# EAGLE design XBee-NewRoute (EAGLE 7.4.0)
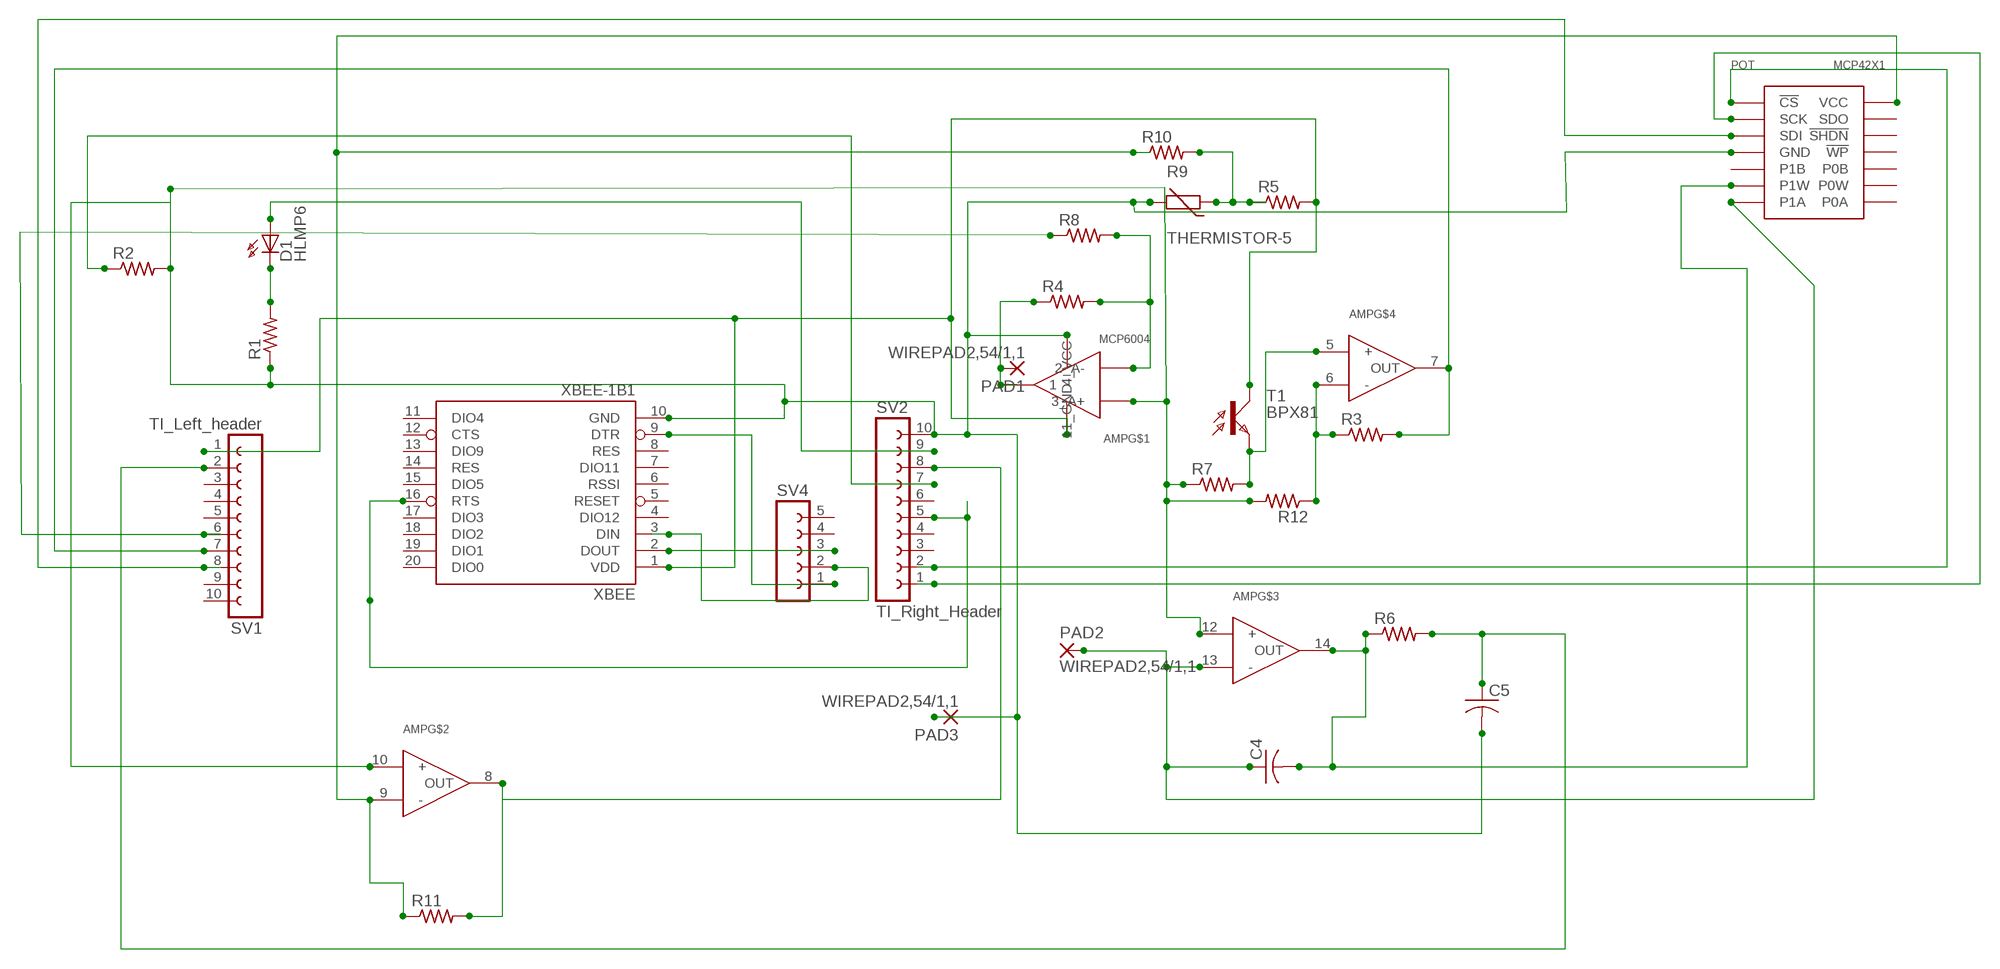
[diagram p0: schematic, sheet 1]

## Parts
AMP  MCP6004  [SO014]
C4  C-USC0603  [C0603]
C5  C-USC0603  [C0603]
D1  HLMP6  [HLMP6]
PAD1  WIREPAD2,54/1,1  [2,54/1,1]
PAD2  WIREPAD2,54/1,1  [2,54/1,1]
PAD3  WIREPAD2,54/1,1  [2,54/1,1]
POT  MCP42X1  MCP42X1_DIGITAL_POTSO014  [SO014]
R1  R-US_R0603  [R0603]
R2  R-US_R0603  [R0603]
R3  R-US_R0603  [R0603]
R4  R-US_R0603  [R0603]
R5  R-US_R0603  [R0603]
R6  R-US_R0603  [R0603]
R7  R-US_R0603  [R0603]
R8  R-US_R0603  [R0603]
R9  THERMISTOR-5  [R-5]
R10  R-US_R0603  [R0603]
R11  R-US_R0603  [R0603]
R12  R-US_R0603  [R0603]
SV1  TI_Left_header  FE10-1  [FE10]
SV2  TI_Right_Header  FE10-1  [FE10]
SV4  FE05-1  [FE05-1]
T1  BPX81  [BPX81]
XBEE  XBEE-1B1  [XBEE-1]

## Nets
GND: AMP.3(3_A+) AMP.10(+) AMP.11(11_GND) AMP.12(+) C5.2 PAD3.1(P) POT.P4(GND) R1.1 R2.2 R7.1 R9.2 R12.2 SV2.10 XBEE.10(GND)
N$1: D1.K R1.2
N$2: AMP.5(+) R7.2 T1.E
N$3: SV4.3 XBEE.2(DOUT)
N$4: SV4.1 XBEE.9(DTR)
N$5: SV4.2 XBEE.3(DIN)
N$6: AMP.6(-) R3.1 R12.1
N$11: R2.1 SV2.7
N$12: AMP.8(OUT) R11.2 SV2.8
N$13: AMP.9(-) POT.P14(VCC) R10.1 R11.1
N$14: AMP.1 PAD1.1(P) R4.1
N$15: D1.A SV2.9
N$17: AMP.13(-) C4.1 PAD2.1(P) POT.P7(P1A)
N$18: AMP.14(OUT) C4.2 POT.P6(P1W) R6.1
N$19: C5.1 R6.2 SV1.2
N$20: R5.1 R9.1 R10.2
N$21: AMP.2(2_A-) R4.2 R8.2
N$22: SV2.5 XBEE.16(RTS)
POT_CS: POT.P1(!CS) SV2.2
POT_SCK: POT.P2(SCK) SV2.1
POT_SDI: POT.P3(SDI) SV1.8
PULSE: R8.1 SV1.6
TI_PN7_READ: AMP.7(OUT) R3.2 SV1.7
VCC: AMP.4(4_VCC) R5.2 SV1.1 T1.C XBEE.1(VDD)
Unconnected: POT.P5(P1B) POT.P8(P0A) POT.P9(P0W) POT.P10(P0B) POT.P11(!WP) POT.P12(!SHDN) POT.P13(SDO) SV1.3 SV1.4 SV1.5 SV1.9 SV1.10 SV2.3 SV2.4 SV2.6 SV4.4 SV4.5 XBEE.4(DIO12) XBEE.5(RESET) XBEE.6(RSSI) XBEE.7(DIO11) XBEE.8(RES) XBEE.11(DIO4) XBEE.12(CTS) XBEE.13(DIO9) XBEE.14(RES) XBEE.15(DIO5) XBEE.17(DIO3) XBEE.18(DIO2) XBEE.19(DIO1) XBEE.20(DIO0)

## Library data of the parts
AMP = SparkFun-AnalogIC:MCP6004: 14SOIC quad op amp, R2R, low power
C4 C5 = rcl:C-US: CAPACITOR, American symbol
D1 = display-hp:HLMP6: LED 2mm horizontal; MF: AGILENT TECHNOLOGIES; MPN: HLMP-6500; OC_FARNELL: 1652490; OC_NEWARK: 40K0088
PAD1-PAD3 = wirepad:WIREPAD: Wire PAD connect wire on PCB
POT = JackLibrary:MCP42X1_DIGITAL_POT
R1-R8 R10-R12 = resistor:R-US_: RESISTOR, American symbol
R9 = varistor:THERMISTOR: THERMISTOR
SV1 SV2 = con-lsta:FE10-1: FEMALE HEADER; OC_FARNELL: unknown; OC_NEWARK: unknown
SV4 = con-lsta:FE05-1: FEMALE HEADER; OC_FARNELL: unknown; OC_NEWARK: unknown
T1 = opto-trans-siemens:BPX81: PHOTO TRANSISTOR; OC_FARNELL: unknown; OC_NEWARK: unknown
XBEE = SparkFun-RF:XBEE-1: Xbee module footprints SMT header is CONN-09042.

## Board
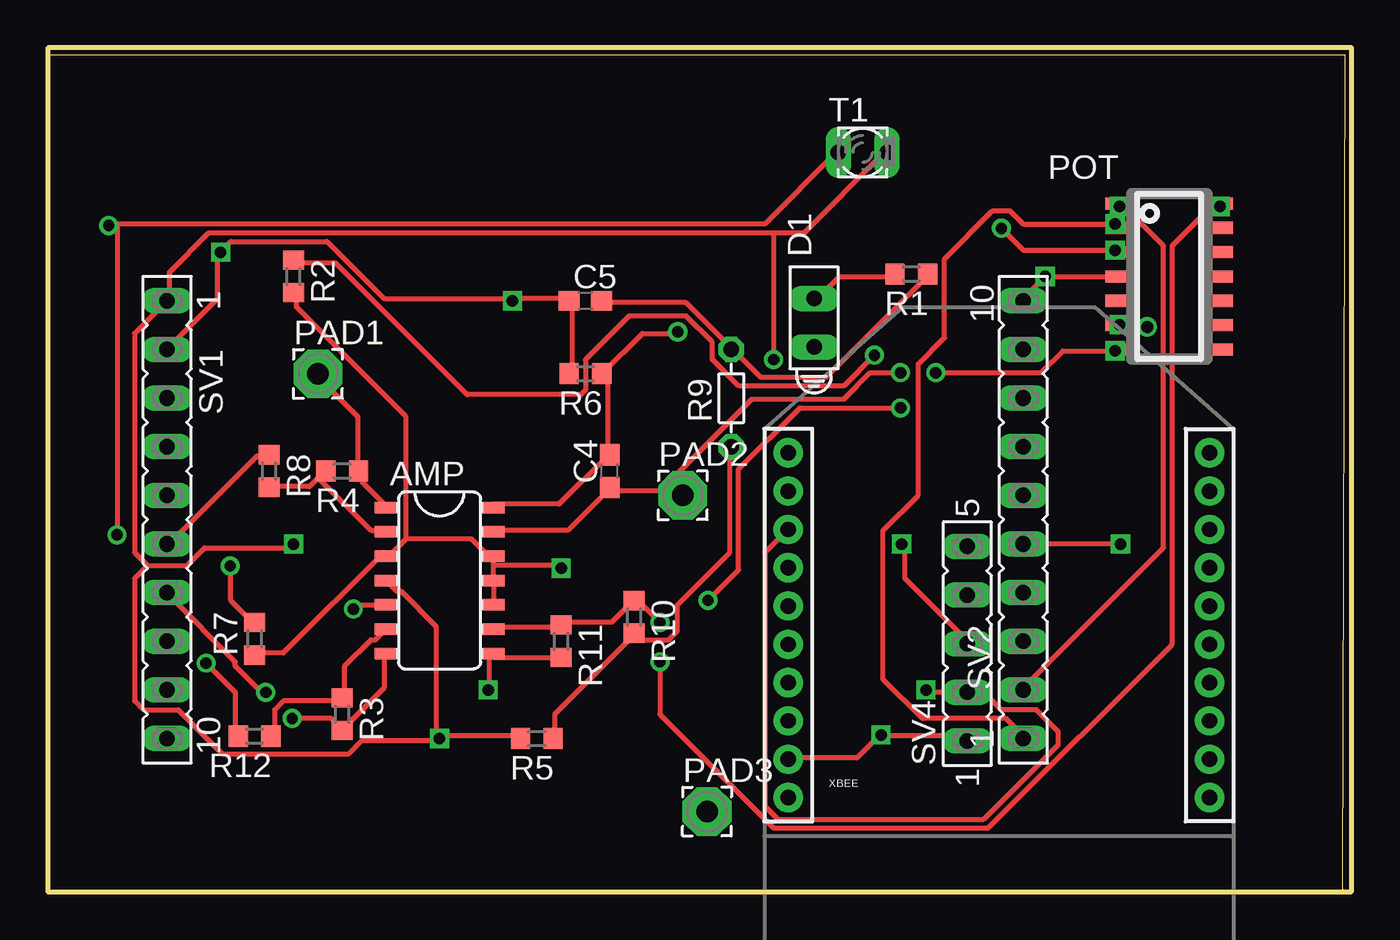
[diagram p1: board, top side]
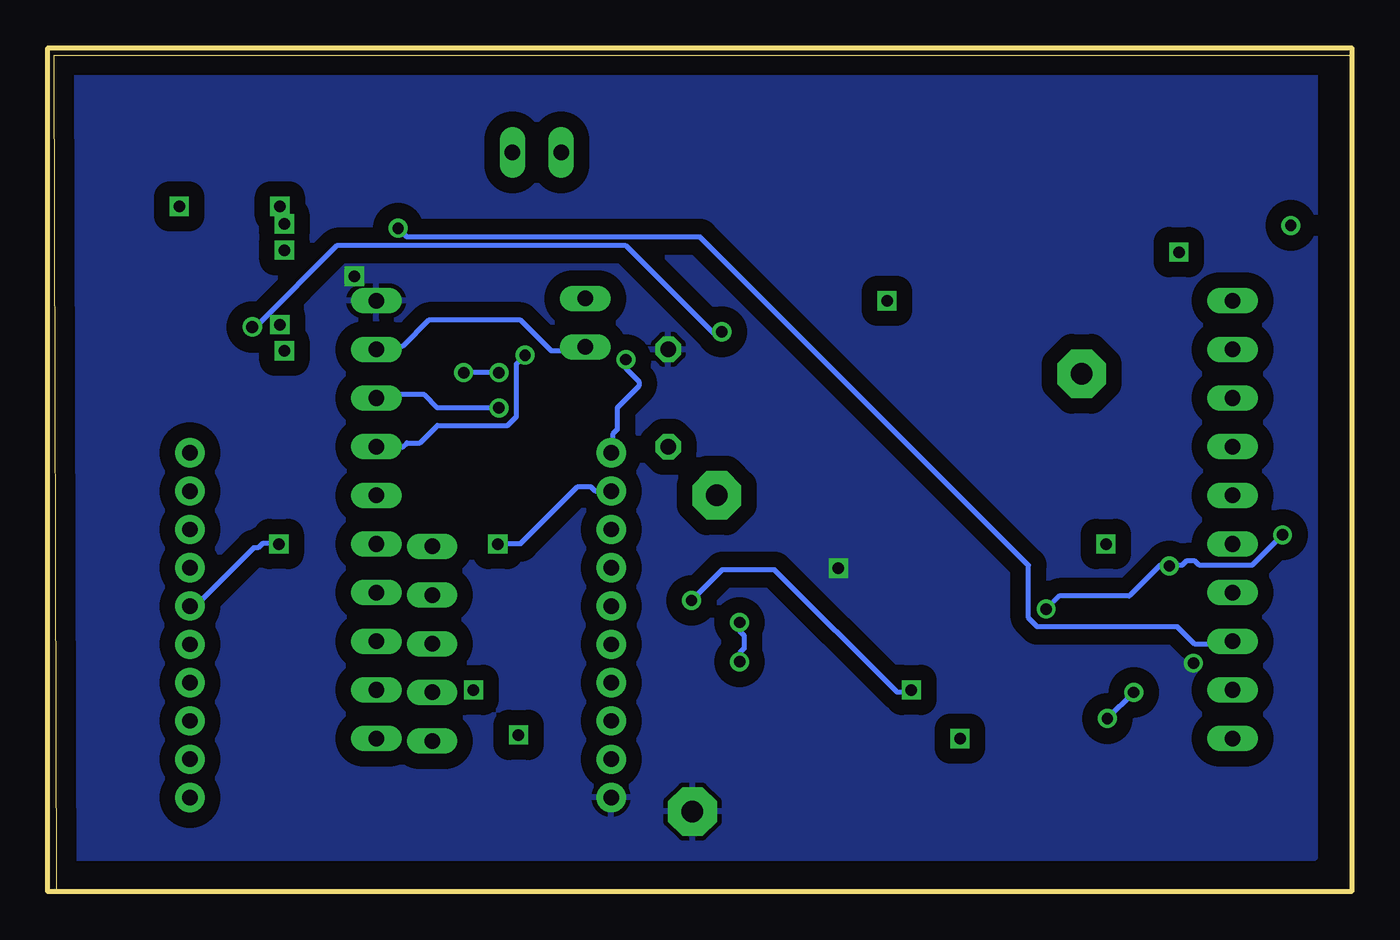
[diagram p2: board, bottom side, seen from below]

Size 68.07 x 44.07 mm. Coordinates in mm from the lower left corner, seen from the top.
Outline: 67.61,0 67.74,43.68 0,43.68
Outline: 0,43.68 0,44.07 68.07,44.07 68.07,0 67.61,0
Outline: 0,43.68 0,0 67.61,0
Copper layers (1*16): Top 0.035mm / dielectric 1.5mm / Bottom 0.035mm
Design rules "default *": minimum track width 10mil, minimum drill 23mil, track to track 8mil, track to pad 8mil, pad to pad 8mil, via to via 8mil, smd to smd 8mil, copper to edge 40mil, drill to drill 8mil, minimum pad ring 10mil, minimum via ring 8mil, stop-mask expansion 4mil, vias tented up to drill 0mil, thermal gap 10mil

### Footprints (pad centres in the part's own frame; a part is rotated, then mirrored left to right if it is on the bottom)
SO014 = smd 0.6 x 1.2: 1 -3.175,-2.8; 2 -1.905,-2.8; 3 -0.635,-2.8; 4 0.635,-2.8; 5 1.905,-2.8; 6 3.175,-2.8; 7 4.445,-2.8; 8 4.445,2.8; 9 3.175,2.8; 10 1.905,2.8; 11 0.635,2.8; 12 -0.635,2.8; 13 -1.905,2.8; 14 -3.175,2.8
C0603 = smd 1.1 x 1: 1 -0.85,0; 2 0.85,0
HLMP6 = drill 0.813 long: A -1.27,0; K 1.27,0
2,54/1,1 = drill 1.118 pad 2.54 octagon: 1 0,0
SO014' = smd 1.27 x 0.635: P1 -2.692,3.81; P2 -2.692,2.54; P3 -2.692,1.27; P4 -2.692,0; P5 -2.692,-1.27; P6 -2.692,-2.54; P7 -2.692,-3.81; P8 2.692,-3.81; P9 2.692,-2.54; P10 2.692,-1.27; P11 2.692,0; P12 2.692,1.27; P13 2.692,2.54; P14 2.692,3.81
R0603 = smd 1 x 1.1: 1 -0.85,0; 2 0.85,0
R-5 = drill 0.813 octagon: 1 -2.54,0; 2 2.54,0
FE10 = drill 0.813 long: 1 -11.43,0; 2 -8.89,0; 3 -6.35,0; 4 -3.81,0; 5 -1.27,0; 6 1.27,0; 7 3.81,0; 8 6.35,0; 9 8.89,0; 10 11.43,0
FE05-1 = drill 0.813 long: 1 -5.08,0; 2 -2.54,0; 3 0,0; 4 2.54,0; 5 5.08,0
BPX81 = drill 0.813 long: C 1.27,0; E -1.27,0
XBEE-1 = drill 0.8 pad 1.524: 1 -11,20; 2 -11,18; 3 -11,16; 4 -11,14; 5 -11,12; 6 -11,10; 7 -11,8; 8 -11,6; 9 -11,4; 10 -11,2; 11 11,2; 12 11,4; 13 11,6; 14 11,8; 15 11,10; 16 11,12; 17 11,14; 18 11,16; 19 11,18; 20 11,20

### Placement (x,y rotation side)
AMP  20.45,16.89 270 top
C4  29.34,21.97 90 top
C5  28.07,30.86 0 top
D1  40,29.72 90 top
PAD1  14.1,27.05 0 top
PAD2  33.15,20.7 0 top
PAD3  34.42,4.19 0 top
POT  MCP42X1  [SO014']  58.55,32.13 0 top
R1  45.09,32.26 180 top
R2  12.83,32.13 270 top
R3  15.37,9.27 270 top
R4  15.37,21.97 180 top
R5  25.53,8 180 top
R6  28.07,27.05 180 top
R7  10.79,13.21 90 top
R8  11.56,21.97 270 top
R9  35.69,25.78 90 top
R10  30.61,14.35 270 top
R11  26.8,13.08 270 top
R12  10.79,8.13 180 top
SV1  6.22,19.43 270 top
SV2  50.93,19.43 90 top
SV4  48.01,12.95 90 top
T1  42.55,38.61 0 top
XBEE  49.66,2.92 0 top

### Tracks (layer width: path | path; a pad name or v marks a point on that pad's centre or on a via)
GND  (via drill 0.58, 0.6)
  Top 0.254: R7.1 10.92,12.47 12.29,12.47 17.55,17.73 AMP.3 17.78,17.5 18.69,18.41 | 18.69,18.41 18.69,24.82 12.98,30.53 12.98,31.22 R2.2 | AMP.10 23.27,14.99 23.27,16.13 AMP.11 23.27,16.36 23.27,17.04 | 23.27,17.04 23.27,17.5 AMP.12 23.04,17.5 22.12,18.41 18.69,18.41 | v8.26,11.94 9.78,10.41 9.78,8.13 R12.2 | C5.2 28.98,30.76 33.32,30.76 35.61,28.47 R9.2 35.84,28.25 37.21,26.87 40.64,26.87 45.9,32.13 R1.1 | POT.P4 v52.07,32.13 50.93,30.99 SV2.10 | 23.27,17.04 26.7,17.04 v26.8,16.89
  pour Bottom (isolate 0.813): 1.9,1.78 1.9,43.18 66.67,43.05 66.67,1.78
N$1
  Top 0.254: R1.2 44.07,32.13 41.33,32.13 40.18,30.99 D1.K
N$2  (via drill 0.58)
  Top 0.254: v9.53,17.02 9.55,16.82 9.55,15.21 10.69,14.07 R7.2 | AMP.5 16.18,14.99 v15.95,14.76 | 3.61,34.87 37.44,34.87 41.1,38.53 T1.E | 3.61,34.87 3.38,34.87 v3.18,34.8 3.61,34.87 | 3.61,34.87 v3.61,18.64
  Bottom 0.254: v15.95,14.76 15.26,15.44 11.61,15.44 10.01,17.04 9.55,17.04 v9.53,17.02 9.32,17.04 8.87,17.04 8.64,17.27 8.18,17.27 7.95,17.04 5.21,17.04 v3.61,18.64
N$3  (via drill 0.6)
  Top 0.254: v44.58,18.16 44.75,17.96 44.75,16.36 47.95,13.16 SV4.3
  Bottom 0.254: XBEE.2 38.81,20.93 39.5,20.93 39.73,21.16 40.41,21.16 43.38,18.19 44.53,18.19 v44.58,18.16
N$4  (via drill 0.6)
  Top 0.254: SV4.1 47.95,7.9 47.73,8.13 43.61,8.13 v43.5,8.19 43.38,8.13 42.24,6.99 38.81,6.99 XBEE.9
N$5  (via drill 0.6)
  Top 0.254: v45.85,10.54 45.9,10.41 SV4.2 48.87,10.41 49.78,9.5 51.61,9.5 52.76,8.36 52.76,7.67 48.87,3.78 38.12,3.78 37.44,4.47 37.44,17.73 38.58,18.87 XBEE.3
N$6
  Top 0.254: R12.1 11.84,8.13 11.84,9.5 12.29,9.96 15.26,9.96 R3.1 15.49,10.19 15.49,11.79 16.87,13.16 17.09,13.16 17.55,13.61 AMP.6
N$11  (via drill 0.58)
  Top 0.254: v43.16,28.02 41.55,26.42 36.07,26.42 34.7,27.79 34.7,28.7 33.32,30.07 30.35,30.07 28.07,27.79 28.07,26.19 27.84,25.96 21.89,25.96 15.04,32.82 12.98,32.82 R2.1
  Bottom 0.254: v43.16,28.02 43.61,27.56 43.61,24.82 44.07,24.36 47.73,24.36 48.64,23.44 49.33,23.44 49.55,23.22 50.93,23.22 SV2.7
N$12  (via drill 0.58, 0.6)
  Top 0.254: v22.99,10.54 23.04,10.64 23.04,12.24 AMP.8 23.27,12.24 26.7,12.24 R11.2 | v44.53,25.27 39.27,25.27 36.07,22.07 36.07,16.82 v34.47,15.21
  Bottom 0.254: v44.53,25.27 47.73,25.27 48.41,25.96 50.93,25.96 SV2.8 | v34.47,15.21 32.87,16.82 30.12,16.82 23.72,10.41 23.04,10.41 v22.99,10.54
N$13  (via drill 0.58, 0.6)
  Top 0.254: AMP.9 23.27,13.84 26.7,13.84 R11.1 26.92,14.07 29.44,14.07 30.58,15.21 R10.1 30.81,15.21 v31.95,14.07 | v31.95,12.01 31.95,9.27 37.9,3.33 49.1,3.33 58.7,12.93 58.7,33.73 60.76,35.79 v61.21,35.79 POT.P14
  Bottom 0.254: v31.95,12.01 31.95,12.47 31.73,12.7 31.73,13.39 31.95,13.61 v31.95,14.07
N$14
  Top 0.254: AMP.1 17.55,20.24 16.41,21.39 16.41,21.84 R4.1 16.18,22.07 16.18,24.82 14.12,26.87 PAD1.1
N$15
  Bottom 0.254: SV2.9 50.93,28.47 49.55,28.47 48.18,29.84 43.38,29.84 41.78,28.25 40.18,28.25 D1.A
N$17  (via drill 0.58, 0.6)
  Top 0.254: 32.87,20.93 29.44,20.93 C4.1 29.21,20.93 27.15,18.87 23.27,18.87 AMP.13 | 32.87,20.93 33.1,20.7 PAD2.1 32.87,20.93 | v46.35,27.1 51.84,27.1 52.98,28.25 v55.73,28.25 POT.P7 | v44.53,27.1 42.93,27.1 41.55,25.73 36.75,25.73 32.87,21.84 32.87,20.93
  Bottom 0.254: v44.53,27.1 v46.35,27.1
N$18  (via drill 0.6, 0.61)
  Top 0.254: v57.4,29.49 57.33,29.62 v55.96,29.62 POT.P6 | v32.89,29.23 32.87,29.16 31.04,29.16 28.98,27.1 R6.1 28.98,26.87 29.21,26.64 29.21,22.99 C4.2 29.21,22.76 26.7,20.24 23.27,20.24 AMP.14
  Bottom 0.254: v57.4,29.49 57.33,29.62 57.1,29.62 52.98,33.73 37.9,33.73 33.1,28.93 32.87,29.16 v32.89,29.23
N$19  (via drill 0.6)
  Top 0.254: R6.2 27.38,27.1 27.38,30.76 C5.1 27.15,30.99 24.41,30.99 v24.26,30.86 24.18,30.99 17.55,30.99 14.58,33.96 9.55,33.96 9.09,33.5 v9.02,33.4 8.87,33.27 8.87,30.99 6.35,28.47 SV1.2
N$20
  Top 0.254: R5.1 26.47,8.13 26.47,9.27 30.58,13.39 R10.2 30.81,13.39 31.04,13.16 32.41,13.16 32.87,13.61 32.87,14.99 35.61,17.73 35.61,23.22 R9.1
N$21
  Top 0.254: 14.12,21.62 14.35,21.84 R4.2 14.12,21.62 | 14.12,21.62 13.67,21.16 11.61,21.16 R8.2 | 14.12,21.62 16.87,18.87 17.55,18.87 AMP.2
N$22  (via drill 0.6)
  Top 0.254: v56.01,18.16 55.96,18.19 50.93,18.19 SV2.5
  Bottom 0.254: XBEE.16 60.53,14.99 60.3,14.99 57.33,17.96 57.1,17.96 56.87,18.19 56.19,18.19 v56.01,18.16
POT_CS  (via drill 0.6)
  Top 0.254: POT.P1 v55.96,35.79 56.41,35.33 56.64,35.33 58.24,33.73 58.24,17.96 50.93,10.64 SV2.2
POT_SCK  (via drill 0.6)
  Top 0.254: POT.P2 v55.73,34.87 50.93,34.87 50.24,35.56 49.33,35.56 46.81,33.05 46.81,28.93 45.44,27.56 45.44,20.7 43.61,18.87 43.61,11.1 45.67,9.04 50.01,9.04 50.93,8.13 SV2.1
POT_SDI  (via drill 0.58, 0.6)
  Top 0.254: v49.78,34.65 50.93,33.5 v55.73,33.5 POT.P3
  Bottom 0.254: v49.78,34.65 49.33,34.19 34.01,34.19 16.87,17.04 16.87,14.3 16.41,13.84 9.09,13.84 8.18,12.93 6.35,12.93 SV1.8
PULSE
  Top 0.254: R8.1 11.38,22.76 10.92,22.76 6.35,18.19 SV1.6
TI_PN7_READ  (via drill 0.58)
  Top 0.254: AMP.7 17.55,12.24 17.55,10.64 15.49,8.59 R3.2 15.26,8.59 14.81,9.04 v12.75,9.04 | v11.38,10.41 11.15,10.41 9.78,11.79 9.78,12.01 6.35,15.44 SV1.7
  Bottom 0.254: v12.75,9.04 v11.38,10.41
VCC  (via drill 0.58, 0.6)
  Top 0.254: v20.45,8 20.52,8.13 24.64,8.13 R5.2 | AMP.4 17.78,16.13 18.24,15.67 18.47,15.67 20.3,13.84 20.3,8.13 v20.45,8 | 5.21,17.04 7.26,17.04 8.18,17.96 12.75,17.96 v12.83,18.16 | 5.21,17.04 4.52,17.73 4.52,29.16 SV1.1 6.35,30.99 6.35,32.36 8.41,34.42 37.9,34.42 | 37.9,34.42 39.5,34.42 43.61,38.53 T1.C | 37.9,34.42 v37.9,27.79 | 5.21,17.04 4.52,16.36 4.52,9.96 4.98,9.5 6.81,9.5 9.09,7.21 15.72,7.21 16.41,7.9 20.3,7.9 v20.45,8
  Bottom 0.254: v37.9,27.79 37.9,27.33 37.21,26.64 37.21,26.42 38.35,25.27 38.35,24.13 38.58,23.9 38.58,22.99 XBEE.1